# EAGLE design Blinky (EAGLE 8.2.1)
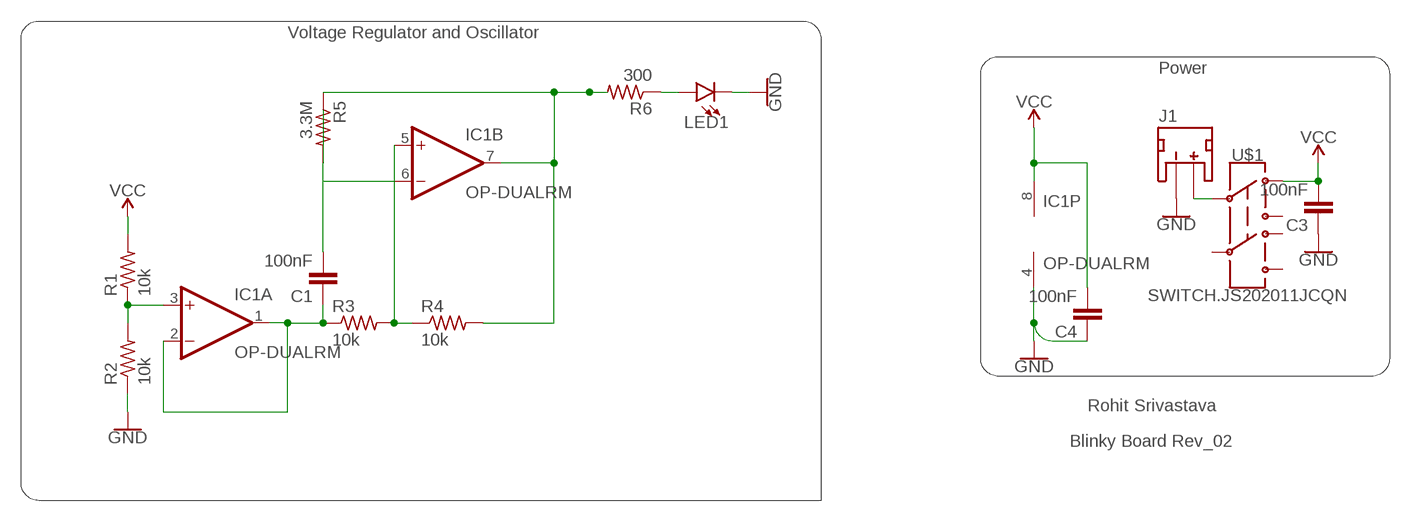
[diagram p0: schematic, sheet 1]

## Parts
C1  100nF  CAPACITOR0402  [C0402]
C3  100nF  CAPACITOR0402  [C0402]
C4  100nF  CAPACITOR0402  [C0402]
IC1  OP-DUALRM  [MSOP08]
J1  JST_2MM_MALE  [JST-2-SMD]
LED1  LED0603  [LED-0603]
R1  10k  RESISTOR0402  [R0402]
R2  10k  RESISTOR0402  [R0402]
R3  10k  RESISTOR0402  [R0402]
R4  10k  RESISTOR0402  [R0402]
R5  3.3M  RESISTOR0402  [R0402]
R6  300  RESISTOR0402  [R0402]
U$1  SWITCH.JS202011JCQN  [SWITCH.00]

## Nets
GND: C3.1 C4.1 IC1.4(P:V-) J1.1(-) LED1.C R2.1
N$2: J1.2(+) U$1.2
N$3: C1.1 IC1.1(A:OUT) IC1.2(A:-IN) R3.1
N$4: IC1.5(B:+IN) R3.2 R4.1
N$5: C1.2 IC1.6(B:-IN) R5.2
N$6: IC1.3(A:+IN) R1.1 R2.2
N$7: IC1.7(B:OUT) R4.2 R5.1 R6.2
N$8: LED1.A R6.1
VCC: C3.2 C4.2 IC1.8(P:V+) R1.2 U$1.1
Unconnected: J1.NC1(PAD1) J1.NC2(PAD2) U$1.3 U$1.5 U$1.6 U$1.7

## Notes on the sheet
- Voltage Regulator and Oscillator
- Power
- Rohit Srivastava
- Blinky Board Rev_02

## Library data of the parts
C1 C3 C4 = CalvEngIO-Passives:CAPACITOR
IC1 = CalvEngIO-AnalogIC:OP-DUAL: Precision Micropower, Low Noise CMOS, Rail-to-Rail Input/Output Operational Amplifiers Source: http://www.analog.com/static/imported-files/data_sheets/AD8603_8607_8609.pdf; MF: ALTERA CORPORATION; MPN: AD8607ARMZ-REEL; OC_FARNELL: 1464990; OC_NEWARK: 59K6925
J1 = CalvEngIO-Connectors:JST_2MM_MALE: JST 2MM MALE RA CONNECTOR Two pin, compact surface mount connector. Commonly used as a battery input connection point. We really like the solid locking feeling and high current rating on these small connectors. We use these all the time as battery connectors. Mates to single-cell LiPo batteries. Here is the connector we sell at SparkFun: JST Right Angle Connector - White <https://www.sparkfun.com/products/8612> (PRT-08612) Datasheet <http://www.sparkfun.com/datasheets/Prototyping/Connectors/JST-Horizontal.pdf> It was used on these SparkFun products: SparkFun MOSFET Power Controller <https://www.sparkfun.com/products/11214> (PRT-11214) SparkFun Battery Babysitter - LiPo Battery Manager <https://www.sparkfun.com/products/13777> (PRT-13777) And many, many others that required a lipo battery connection.; PROD_ID: CONN-11443; SF_ID: PRT-08612
LED1 = CalvEngIO-LED:LED: LED (Generic) Standard schematic elements and footprints for 5mm, 3mm, 1206, and 0603 sized LEDs. Generic LEDs with no color specified. LTST-C190KGKT: arrow indicates cathode
R1-R6 = CalvEngIO-Passives:RESISTOR
U$1 = CalvEngIO-Switches:SWITCH.JS202011JCQN

## Net classes
0 default: width 2.032 mm, drill 0.508 mm, clearance 0.203 mm

## Board
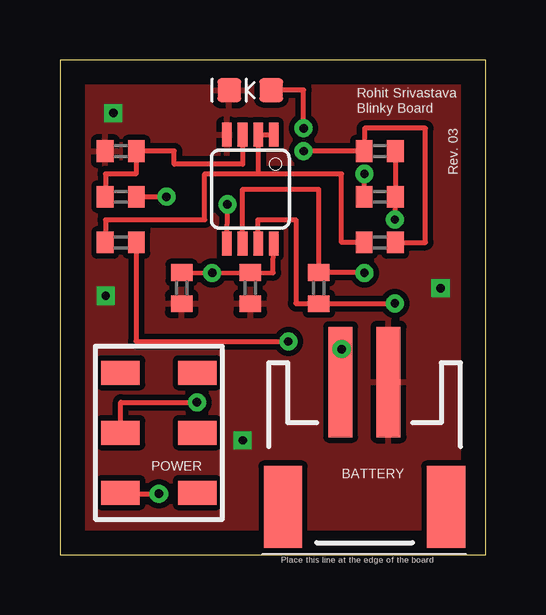
[diagram p1: board, top side]
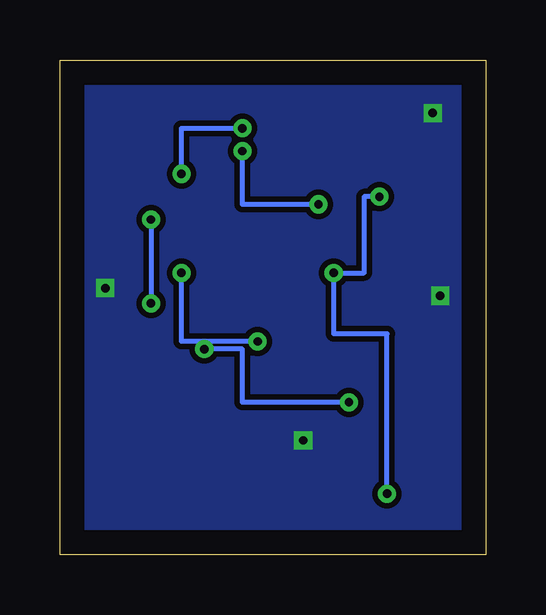
[diagram p2: board, bottom side, seen from below]

Size 17.77 x 20.63 mm. Coordinates in mm from the lower left corner, seen from the top.
Outline: 0,0 17.77,0 17.77,20.63 0,20.63 0,0
Copper layers (1*16): Top 0.035mm / dielectric 1.5mm / Bottom 0.035mm
Design rules "default": minimum track width 6mil, minimum drill 0.35mm, track to track 6mil, track to pad 6mil, pad to pad 6mil, via to via 6mil, smd to smd 6mil, copper to edge 40mil, drill to drill 6mil, minimum pad ring 10mil, minimum via ring 8mil, stop-mask expansion 4mil, vias tented up to drill 0mil, thermal gap 10mil

### Footprints (pad centres in the part's own frame; a part is rotated, then mirrored left to right if it is on the bottom)
C0402 = smd 0.7 x 0.9: 1 -0.65,0; 2 0.65,0
MSOP08 = smd 0.4 x 1: 1 -0.976,-2.263; 2 -0.326,-2.263; 3 0.324,-2.263; 4 0.974,-2.263; 5 0.974,2.262; 6 0.324,2.262; 7 -0.326,2.262; 8 -0.976,2.262
JST-2-SMD = smd 1 x 4.6: 1 -1,-3.7; 2 1,-3.7 | smd 1.6 x 3.4: NC1 -3.4,1.5; NC2 3.4,1.5
LED-0603 = smd 1 x 1: A -0.877,0; C 0.877,0
R0402 = smd 0.7 x 0.9: 1 -0.65,0; 2 0.65,0
SWITCH.00 = smd 1 x 1.6: 1 -2.5,1.6; 2 0,1.6; 3 2.5,1.6; 5 -2.5,-1.6; 6 0,-1.6; 7 2.5,-1.6

### Placement (x,y rotation side)
C1  2.54,13.02 0 top
C3  5.08,11.11 90 top
C4  7.94,11.11 90 top
IC1  7.94,15.24 180 top
J1  12.7,3.49 180 top
LED1  7.94,19.37 180 top
R1  2.54,14.92 0 top
R2  2.54,16.83 0 top
R3  13.34,13.02 0 top
R4  13.34,16.83 0 top
R5  10.79,11.11 90 top
R6  13.34,14.92 0 top
U$1  4.13,5.08 90 top

### Tracks (layer width: path | path; a pad name or v marks a point on that pad's centre or on a via)
GND  (via drill 0.35)
  other vias: 15.88,11.11 2.22,18.41 7.62,4.76 1.91,10.79
  pour Bottom (isolate 0.229): -1.91,22.23 21.27,22.23 21.27,-6.03 -3.17,-6.03 -3.17,-1.59 -3.17,22.23
  pour Top (isolate 0.229): -0.32,21.27 18.1,21.27 18.41,20.95 18.41,-1.27 -1.27,-1.27 -1.59,-0.95 -1.59,20.95 -1.27,21.27
N$2  (via drill 0.35)
  Top 0.203: U$1.2 2.54,5.09 2.54,6.35 v5.71,6.35 | v11.75,8.57 11.7,8.53 J1.2
  Bottom 0.203: v5.71,6.35 10.16,6.35 10.16,8.57 v11.75,8.57
N$3
  Top 0.203: C1.1 1.91,13.97 6.03,13.97 6.03,15.88 8.26,15.88 | 8.26,15.88 IC1.2 IC1.1 | R3.1 11.75,13.02 11.75,15.88 8.26,15.88
N$4  (via drill 0.35)
  Top 0.203: IC1.5 v6.99,14.61 | v10.16,16.83 R4.1 12.7,17.78 15.24,17.78 15.24,13.02 R3.2
  Bottom 0.203: v6.99,14.61 10.16,14.61 v10.16,16.83
N$5  (via drill 0.35)
  Top 0.203: IC1.6 7.62,15.24 10.79,15.24 R5.2 12.69,11.76 v12.7,11.75 | C1.2 3.17,13 3.17,8.89 v9.53,8.89
  Bottom 0.203: v9.53,8.89 12.7,8.89 v12.7,11.75
N$6
  Top 0.203: R1.1 1.91,15.88 3.17,15.88 R2.2 4.76,16.83 4.76,16.28 7.62,16.28 7.62,16.6 IC1.3
N$7  (via drill 0.35)
  Top 0.203: R4.2 R6.2 v13.97,13.97 | v13.97,10.48 13.96,10.46 R5.1 9.86,10.46 9.84,10.48 9.84,13.97 8.26,13.97 IC1.7
  Bottom 0.203: v13.97,13.97 v13.97,10.48
N$8  (via drill 0.35)
  Top 0.203: R6.1 12.7,14.94 v12.7,15.88 | v10.16,17.78 10.16,19.37 LED1.A
  Bottom 0.203: v12.7,15.88 12.7,17.78 v10.16,17.78
VCC  (via drill 0.35)
  Top 0.203: R1.2 v4.45,14.92 | C3.2 v6.35,11.75 C4.2 8.89,11.75 IC1.8 | U$1.1 2.57,2.54 v4.13,2.54
  Bottom 0.203: v4.45,14.92 5.08,14.92 5.08,11.75 v6.35,11.75 6.35,9.21 4.13,9.21 v4.13,2.54

### Text on the board
tNames: Rohit Srivastava | Blinky Board | Rev. 03 | POWER | BATTERY